# Altium schematic sheet AnalogFrontEnd.SchDoc
size A4
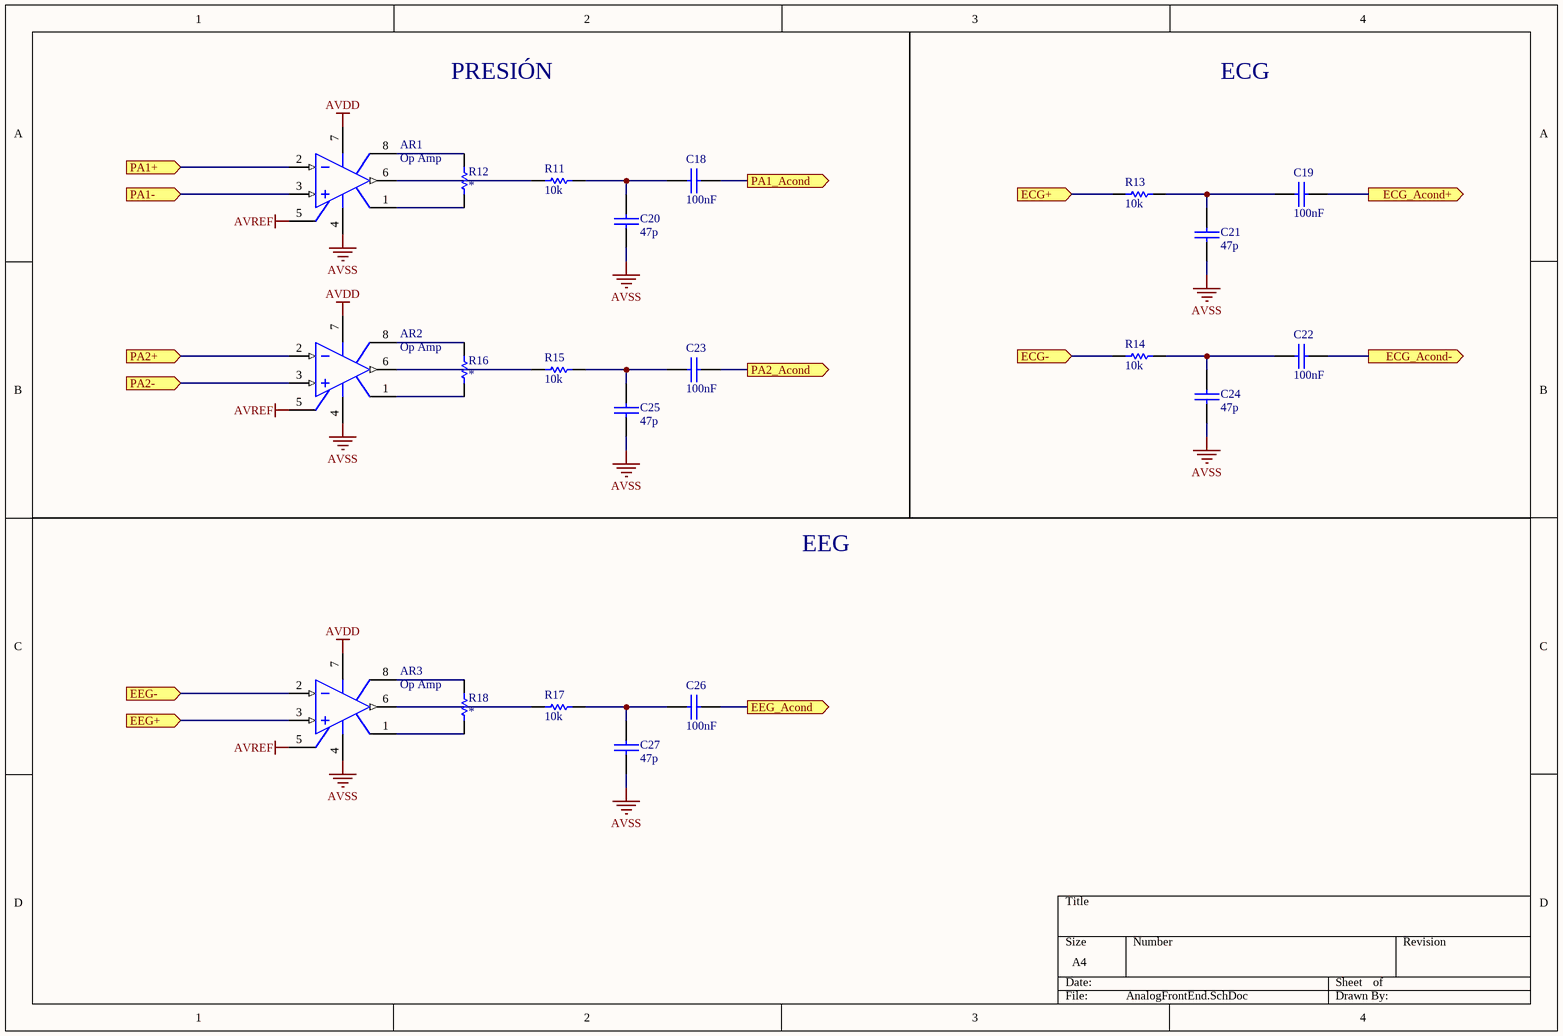
[diagram p0: AnalogFrontEnd.SchDoc]

## Parts
AR1  Op Amp  [SOIC8]
AR2  Op Amp  [SOIC8]
AR3  Op Amp  [SOIC8]
C18  value 100nF  [0805]  (hidden comment: Capacitor)
C19  value 100nF  [0805]  (hidden comment: Capacitor)
C20  value 47p  [0805]  (hidden comment: Capacitor)
C21  value 47p  [0805]  (hidden comment: Capacitor)
C22  value 100nF  [0805]  (hidden comment: Capacitor)
C23  value 100nF  [0805]  (hidden comment: Capacitor)
C24  value 47p  [0805]  (hidden comment: Capacitor)
C25  value 47p  [0805]  (hidden comment: Capacitor)
C26  value 100nF  [0805]  (hidden comment: Capacitor)
C27  value 47p  [0805]  (hidden comment: Capacitor)
R11  value 10k  [0805]  (hidden comment: Resistor)
R12  Resistor  [0805]  (value not drawn)
R13  value 10k  [0805]  (hidden comment: Resistor)
R14  value 10k  [0805]  (hidden comment: Resistor)
R15  value 10k  [0805]  (hidden comment: Resistor)
R16  Resistor  [0805]  (value not drawn)
R17  value 10k  [0805]  (hidden comment: Resistor)
R18  Resistor  [0805]  (value not drawn)

## Ports
ECG+ (in), ECG- (in), ECG_Acond+ (out), ECG_Acond- (out), EEG+ (in), EEG- (in), EEG_Acond (out), PA1+ (in), PA1- (in), PA1_Acond (out), PA2+ (in), PA2- (in), PA2_Acond (out)

## Nets
AVDD: AR1.7(V+) AR2.7(V+) AR3.7(V+)
AVREF: AR1.5(OS_NUL) AR2.5(OS_NUL) AR3.5(OS_NUL)
AVSS: AR1.4(V-) AR2.4(V-) AR3.4(V-) C20.2 C21.2 C24.2 C25.2 C27.2
ECG+: R13.1 ; port ECG+
ECG-: R14.1 ; port ECG-
ECG_Acond+: C19.2 ; port ECG_Acond+
ECG_Acond-: C22.2 ; port ECG_Acond-
EEG+: AR3.3(IN+) ; port EEG+
EEG-: AR3.2(IN-) ; port EEG-
EEG_Acond: C26.2 ; port EEG_Acond
PA1+: AR1.2(IN-) ; port PA1+
PA1-: AR1.3(IN+) ; port PA1-
PA1_Acond: C18.2 ; port PA1_Acond
PA2+: AR2.2(IN-) ; port PA2+
PA2-: AR2.3(IN+) ; port PA2-
PA2_Acond: C23.2 ; port PA2_Acond
NetAR1_1: AR1.1(OS_NUL) R12.1
NetAR1_6: AR1.6(OUT) R11.1
NetAR1_8: AR1.8(TAB) R12.2
NetAR2_1: AR2.1(OS_NUL) R16.1
NetAR2_6: AR2.6(OUT) R15.1
NetAR2_8: AR2.8(TAB) R16.2
NetAR3_1: AR3.1(OS_NUL) R18.1
NetAR3_6: AR3.6(OUT) R17.1
NetAR3_8: AR3.8(TAB) R18.2
NetC18_1: C18.1 C20.1 R11.2
NetC19_1: C19.1 C21.1 R13.2
NetC22_1: C22.1 C24.1 R14.2
NetC23_1: C23.1 C25.1 R15.2
NetC26_1: C26.1 C27.1 R17.2

## Notes on the sheet
- PRESIÓN
- ECG
- EEG

## Library data of the parts
AR1-AR3 = Op Amp: FET Operational Amplifier; Published: 8-Jun-2000; LatestRevisionDate: 17-Jul-2002; LatestRevisionNote: Re-released for DXP Platform.; DatasheetVersion: REV. B; PackageVersion: 1990; PackageReference: H-08A; Publisher: Altium Limited; PackageDescription: Can; 8 Leads; Pin Circle Dia. 5.08 mm; Lead Dia. 0.53 mm (max); ComponentLink1Description: Manufacturer Link; ComponentLink1URL: http://www.analog.com/
C18-C27 = Capacitor: Dielectric: *; Voltage: *
R11-R18 = Resistor
  R12 R16 R18: Value: *